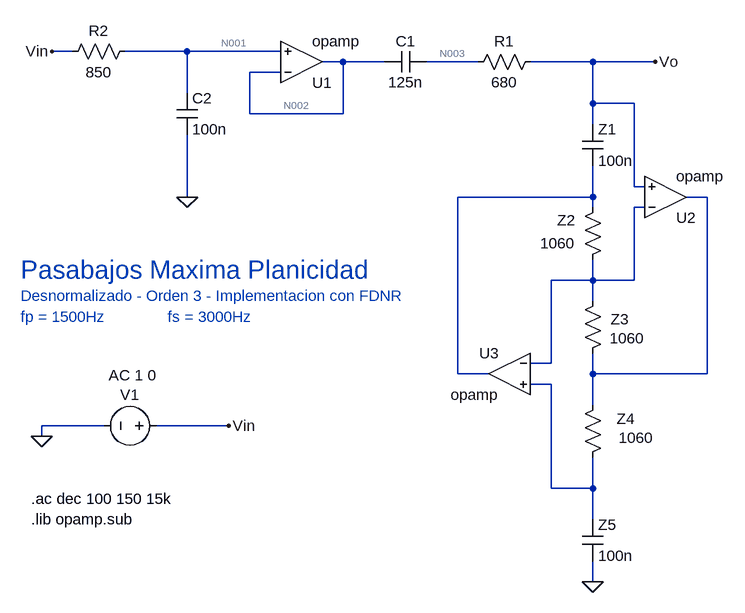
[diagram p0: schematic Circuito_Des_FDNR.asc]
Circuito_Des_FDNR.asc, the LTspice schematic file:
Version 4
SHEET 1 1416 964
WIRE 272 128 240 128
WIRE 448 128 352 128
WIRE 592 128 448 128
WIRE 688 144 656 144
WIRE 752 144 688 144
WIRE 896 144 816 144
WIRE 1072 144 976 144
WIRE 1168 144 1072 144
WIRE 592 160 544 160
WIRE 448 192 448 128
WIRE 1072 208 1072 144
WIRE 1136 208 1072 208
WIRE 544 224 544 160
WIRE 688 224 688 144
WIRE 688 224 544 224
WIRE 1072 240 1072 208
WIRE 1136 336 1136 208
WIRE 1152 336 1136 336
WIRE 448 352 448 256
WIRE 1072 352 1072 304
WIRE 1072 352 864 352
WIRE 1248 352 1216 352
WIRE 1072 368 1072 352
WIRE 1152 368 1136 368
WIRE 1072 480 1072 448
WIRE 1072 480 1008 480
WIRE 1136 480 1136 368
WIRE 1136 480 1072 480
WIRE 1072 512 1072 480
WIRE 1008 608 1008 480
WIRE 1008 608 976 608
WIRE 864 624 864 352
WIRE 912 624 864 624
WIRE 1072 624 1072 592
WIRE 1248 624 1248 352
WIRE 1248 624 1072 624
WIRE 1008 640 976 640
WIRE 1072 672 1072 624
WIRE 320 704 224 704
WIRE 512 704 400 704
WIRE 224 720 224 704
WIRE 1008 800 1008 640
WIRE 1072 800 1072 752
WIRE 1072 800 1008 800
WIRE 1072 848 1072 800
WIRE 1072 944 1072 912
FLAG 448 352 0
FLAG 240 128 Vin
FLAG 1168 144 Vo
FLAG 224 720 0
FLAG 512 704 Vin
FLAG 1072 944 0
SYMBOL OpAmps\\opamp 624 208 M180
SYMATTR InstName U1
SYMBOL res 992 128 R90
WINDOW 0 0 56 VBottom 2
WINDOW 3 32 56 VTop 2
SYMATTR InstName R1
SYMATTR Value 680
SYMBOL res 368 112 R90
WINDOW 0 0 56 VBottom 2
WINDOW 3 32 56 VTop 2
SYMATTR InstName R2
SYMATTR Value 850
SYMBOL cap 816 128 R90
WINDOW 0 0 32 VBottom 2
WINDOW 3 32 32 VTop 2
SYMATTR InstName C1
SYMATTR Value 125n
SYMBOL cap 432 192 R0
SYMATTR InstName C2
SYMATTR Value 100n
SYMBOL voltage 416 704 R90
WINDOW 0 -32 56 VBottom 2
WINDOW 3 32 56 VTop 2
WINDOW 123 -62 52 VBottom 2
WINDOW 39 0 0 Left 0
SYMATTR InstName V1
SYMATTR Value ""
SYMATTR Value2 AC 1 0
SYMBOL OpAmps\\opamp 1184 416 M180
SYMATTR InstName U2
SYMBOL res 1088 656 M0
WINDOW 0 -49 37 Left 2
WINDOW 3 -78 66 Left 2
SYMATTR InstName Z4
SYMATTR Value 1060
SYMBOL res 1088 496 M0
WINDOW 0 -40 44 Left 2
WINDOW 3 -64 73 Left 2
SYMATTR InstName Z3
SYMATTR Value 1060
SYMBOL OpAmps\\opamp 944 560 M0
SYMATTR InstName U3
SYMBOL cap 1056 912 M180
WINDOW 0 24 56 Left 2
WINDOW 3 24 8 Left 2
SYMATTR InstName Z5
SYMATTR Value 100n
SYMBOL cap 1056 304 M180
WINDOW 0 24 56 Left 2
WINDOW 3 24 8 Left 2
SYMATTR InstName Z1
SYMATTR Value 100n
SYMBOL res 1056 464 M180
WINDOW 0 -39 76 Left 2
WINDOW 3 -65 41 Left 2
SYMATTR InstName Z2
SYMATTR Value 1060
TEXT 208 848 Left 2 !.lib opamp.sub
TEXT 208 816 Left 2 !.ac dec 100 150 15k
TEXT 192 464 Left 4 ;Pasabajos Maxima Planicidad
TEXT 192 504 Left 2 ;Desnormalizado - Orden 3 - Implementacion con FDNR
TEXT 192 536 Left 2 ;fp = 1500Hz              fs = 3000Hz

The netlist it stands for:
* Circuito_Des_FDNR.asc
XU1 N002 N001 N002 opamp Aol=100K GBW=10Meg  ; pins invin noninvin out
R1 Vo N003 680
R2 N001 Vin 850
C1 N003 N002 125n
C2 N001 0 100n
V1 Vin 0 AC 1 0
XU2 N006 Vo N005 opamp Aol=100K GBW=10Meg  ; pins invin noninvin out
R§Z4 N005 N007 1060
R§Z3 N006 N005 1060
XU3 N006 N007 N004 opamp Aol=100K GBW=10Meg  ; pins invin noninvin out
C§Z5 0 N007 100n
C§Z1 N004 Vo 100n
R§Z2 N006 N004 1060
.lib opamp.sub
.ac dec 100 150 15k
* Pasabajos Maxima Planicidad
* Desnormalizado - Orden 3 - Implementacion con FDNR
* fp = 1500Hz              fs = 3000Hz
.backanno
.end

* Results of the author's LTspice run, read from the files saved beside the schematic
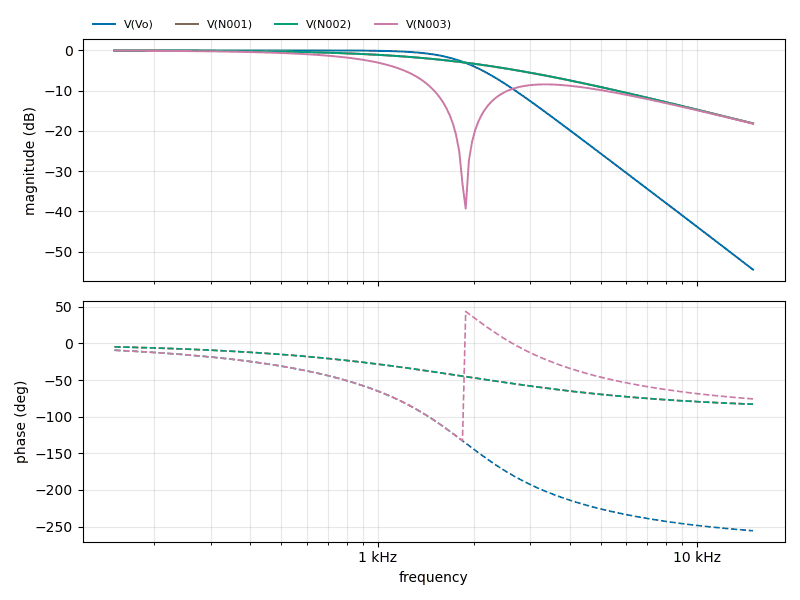
[diagram p1: AC Analysis of Circuito_Des_FDNR.asc, plotted from the saved traces]
* AC Analysis, 1 run:
*   V(Vo): -0.00 dB at 150 Hz, -54.47 dB at 15 kHz, peak -0.00 dB at 150 Hz, 3 dB below the peak at 1.874 kHz
*   V(N001): -0.03 dB at 150 Hz, -18.14 dB at 15 kHz, peak -0.03 dB at 150 Hz, 3 dB below the peak at 1.884 kHz
*   V(N002): -0.03 dB at 150 Hz, -18.14 dB at 15 kHz, peak -0.03 dB at 150 Hz, 3 dB below the peak at 1.884 kHz
*   V(N003): -0.06 dB at 150 Hz, -18.21 dB at 15 kHz, peak -0.06 dB at 150 Hz, 3 dB below the peak at 1.008 kHz